# EAGLE design stm32f7 (EAGLE 6.6.0)
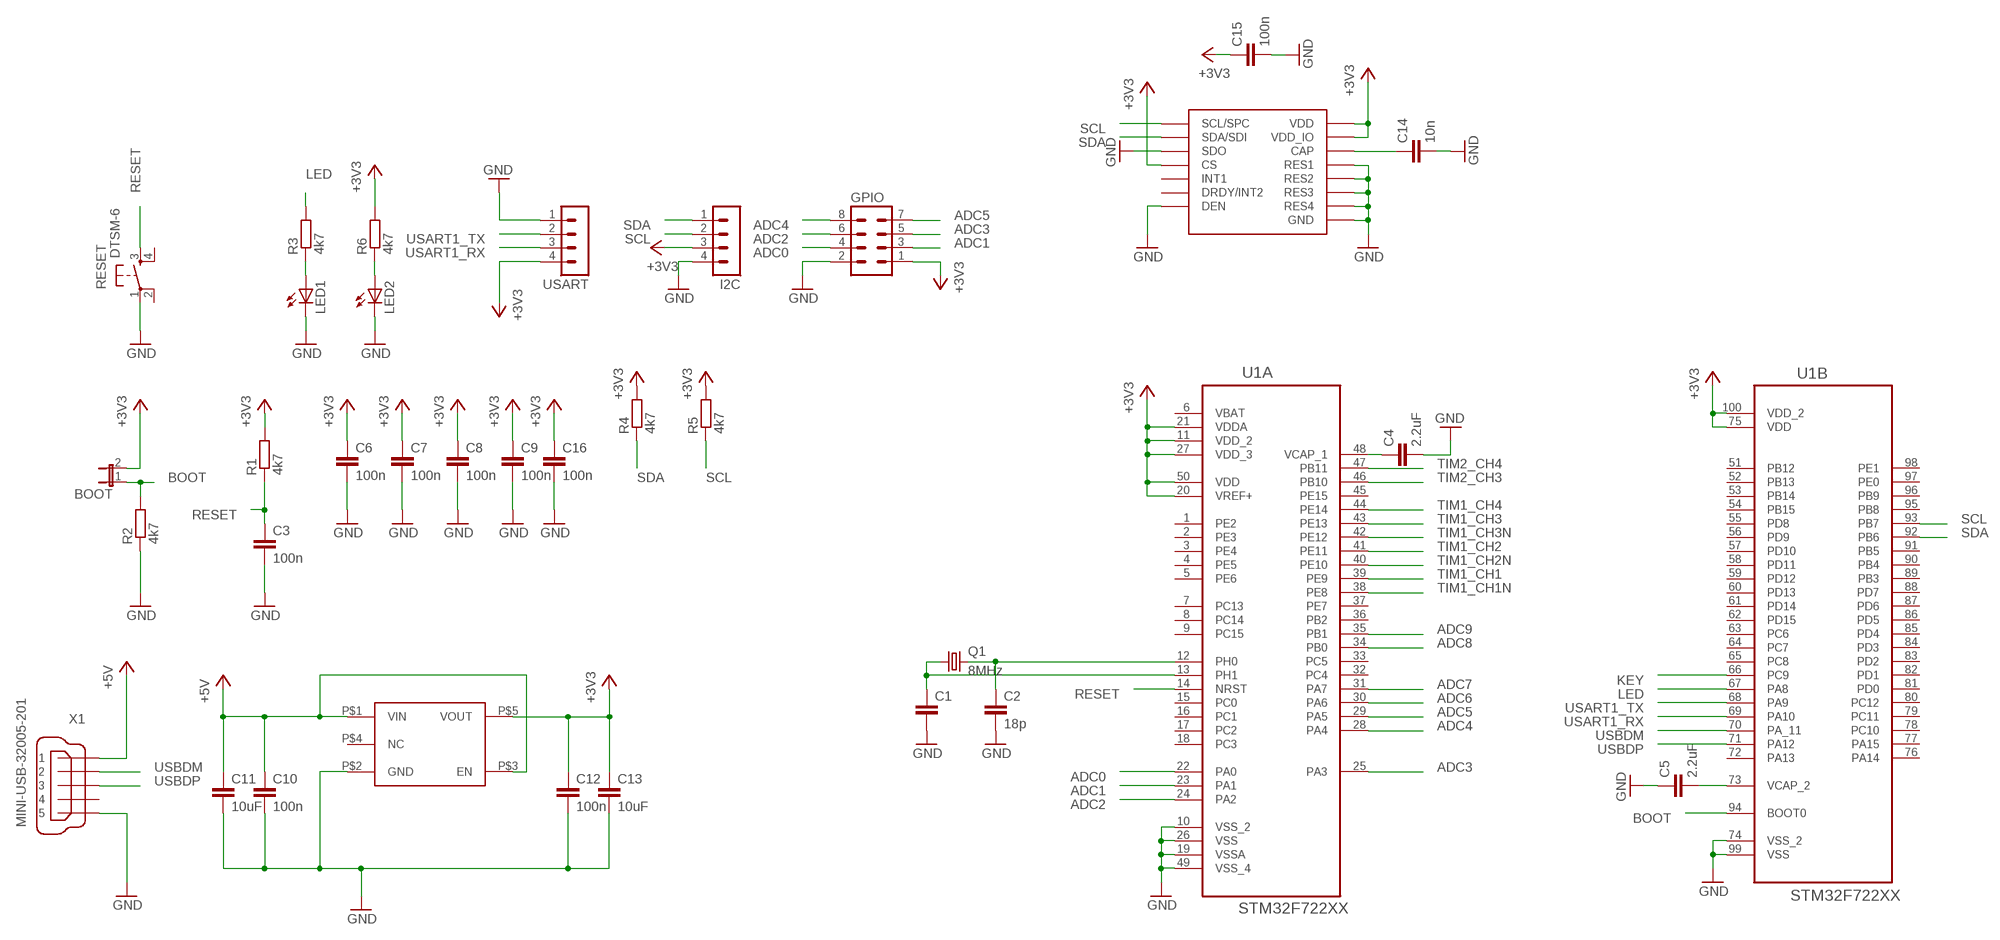
[diagram p0: schematic, sheet 1]

## Parts
BOOT  JP1E  [JP1]
C1  C-EUC0805  [C0805]
C2  18p  C-EUC0805  [C0805]
C3  100n  C-EUC0805  [C0805]
C4  2.2uF  C-EUC0805  [C0805]
C5  2.2uF  C-EUC0805  [C0805]
C6  100n  C-EUC0805  [C0805]
C7  100n  C-EUC0805  [C0805]
C8  100n  C-EUC0805  [C0805]
C9  100n  C-EUC0805  [C0805]
C10  100n  C-EUC0805  [C0805]
C11  10uF  C-EUC0805  [C0805]
C12  100n  C-EUC0805  [C0805]
C13  10uF  C-EUC0805  [C0805]
C14  10n  C-EUC0805  [C0805]
C15  100n  C-EUC0805  [C0805]
C16  100n  C-EUC0805  [C0805]
GPIO  MA04-2  [MA04-2]
I2C  MA04-1  [MA04-1]
LED1  LEDCHIPLED_1206  [CHIPLED_1206]
LED2  LEDCHIPLED_1206  [CHIPLED_1206]
Q1  8MHz  CRYSTALCTS406  [CTS406]
R1  4k7  R-EU_M0805  [M0805]
R2  4k7  R-EU_M0805  [M0805]
R3  4k7  R-EU_M0805  [M0805]
R4  4k7  R-EU_M0805  [M0805]
R5  4k7  R-EU_M0805  [M0805]
R6  4k7  R-EU_M0805  [M0805]
RESET  DTSM-6  [DTSM-6]
U1  STM32F722XX  [QFP50P1600X1600X160-100N]
U$1  MIC5504-3.3Y  [SOT23-5]
U$2  ST_L3GD20H  [ST_LGA16L]
USART  MA04-1  [MA04-1]
X1  MINI-USB-32005-201  [32005-201]

## Nets
+3V3: BOOT.2 C6.1 C7.1 C8.1 C9.1 C12.1 C13.1 C15.1 C16.1 GPIO.1 I2C.3 R1.2 R4.2 R5.2 R6.2 U1.11(A:VDD_2) U1.20(A:VREF+) U1.21(A:VDDA) U1.27(A:VDD_3) U1.50(A:VDD) U1.75(B:VDD) U1.100(B:VDD_2) U$1.P$5(VOUT) U$2.P$1(VDD_IO) U$2.P$5(CS) U$2.P$16(VDD) USART.4
+5V: C10.1 C11.1 U$1.P$1(VIN) U$1.P$3(EN) X1.1
ADC0: GPIO.4 U1.22(A:PA0)
ADC1: GPIO.3 U1.23(A:PA1)
ADC2: GPIO.6 U1.24(A:PA2)
ADC3: GPIO.5 U1.25(A:PA3)
ADC4: GPIO.8 U1.28(A:PA4)
ADC5: GPIO.7 U1.29(A:PA5)
ADC6: U1.30(A:PA6)
ADC7: U1.31(A:PA7)
ADC8: U1.34(A:PB0)
ADC9: U1.35(A:PB1)
BOOT: BOOT.1 R2.2 U1.94(B:BOOT0)
GND: C1.2 C2.2 C3.2 C4.2 C5.1 C6.2 C7.2 C8.2 C9.2 C10.2 C11.2 C12.2 C13.2 C14.2 C15.2 C16.2 GPIO.2 I2C.4 LED1.C LED2.C R2.1 RESET.1 U1.10(A:VSS_2) U1.19(A:VSSA) U1.26(A:VSS) U1.49(A:VSS_4) U1.74(B:VSS_2) U1.99(B:VSS) U$1.P$2(GND) U$2.P$4(SDO) U$2.P$8(DEN) U$2.P$9(RES1) U$2.P$10(RES2) U$2.P$11(RES3) U$2.P$12(GND) U$2.P$13(GND) U$2.P$15(RES4) USART.1 X1.5
KEY: U1.66(B:PC9)
LED: R3.2 U1.67(B:PA8)
N$1: C2.1 Q1.3 U1.12(A:PH0)
N$2: C1.1 Q1.1 U1.13(A:PH1)
N$3: C4.1 U1.48(A:VCAP_1)
N$4: C5.2 U1.73(B:VCAP_2)
N$5: LED1.A R3.1
N$6: C14.1 U$2.P$14(CAP)
N$11: LED2.A R6.1
RESET: C3.1 R1.1 RESET.3 U1.14(A:NRST)
SCL: I2C.2 R5.1 U1.93(B:PB7) U$2.P$2(SCL/SPC)
SDA: I2C.1 R4.1 U1.92(B:PB6) U$2.P$3(SDA/SDI)
TIM1_CH1: U1.39(A:PE9)
TIM1_CH1N: U1.38(A:PE8)
TIM1_CH2: U1.41(A:PE11)
TIM1_CH2N: U1.40(A:PE10)
TIM1_CH3: U1.43(A:PE13)
TIM1_CH3N: U1.42(A:PE12)
TIM1_CH4: U1.44(A:PE14)
TIM2_CH3: U1.46(A:PB10)
TIM2_CH4: U1.47(A:PB11)
USART1_RX: U1.69(B:PA10) USART.3
USART1_TX: U1.68(B:PA9) USART.2
USBDM: U1.70(B:PA_11) X1.2
USBDP: U1.71(B:PA12) X1.3
Unconnected: RESET.2 RESET.4 U1.1(A:PE2) U1.2(A:PE3) U1.3(A:PE4) U1.4(A:PE5) U1.5(A:PE6) U1.7(A:PC13) U1.8(A:PC14) U1.9(A:PC15) U1.15(A:PC0) U1.16(A:PC1) U1.17(A:PC2) U1.18(A:PC3) U1.32(A:PC4) U1.33(A:PC5) U1.36(A:PB2) U1.37(A:PE7) U1.45(A:PE15) U1.51(B:PB12) U1.52(B:PB13) U1.53(B:PB14) U1.54(B:PB15) U1.55(B:PD8) U1.56(B:PD9) U1.57(B:PD10) U1.58(B:PD11) U1.59(B:PD12) U1.60(B:PD13) U1.61(B:PD14) U1.62(B:PD15) U1.63(B:PC6) U1.64(B:PC7) U1.65(B:PC8) U1.72(B:PA13) U1.76(B:PA14) U1.77(B:PA15) U1.78(B:PC10) U1.79(B:PC11) U1.80(B:PC12) U1.81(B:PD0) U1.82(B:PD1) U1.83(B:PD2) U1.84(B:PD3) U1.85(B:PD4) U1.86(B:PD5) U1.87(B:PD6) U1.88(B:PD7) U1.89(B:PB3) U1.90(B:PB4) U1.91(B:PB5) U1.95(B:PB8) U1.96(B:PB9) U1.97(B:PE0) U1.98(B:PE1) U$1.P$4(NC) U$2.P$6(DRDY/INT2) U$2.P$7(INT1) X1.4

## Power pins joined to a net without a drawn wire
VBAT: U1.6(A:VBAT)

## Library data of the parts
BOOT = jumper:JP1E: JUMPER
C1-C16 = resistor:C-EU: CAPACITOR, European symbol
GPIO = con-lstb:MA04-2: PIN HEADER; OC_FARNELL: unknown; OC_NEWARK: unknown
I2C USART = con-lstb:MA04-1: PIN HEADER; OC_FARNELL: unknown; OC_NEWARK: unknown
LED1 LED2 = my_parts:LED: LED OSRAM: - CHIPLED LG R971, LG N971, LY N971, LG Q971, LY Q971, LO R971, LY R971 LH N974, LH R974 LS Q976, LO Q976, LY Q976 LO Q996 - Hyper CHIPLED LW Q18S LB Q993, LB Q99A, LB R99A - SideLED LS A670, LO A670, LY A670, LG A670, LP A670 LB A673, LV A673, LT A673, LW A673 LH A674 LY A675 LS A676, LA A676, LO A676, LY A676, LW A676 LS A679, LY A679, LG A679 - Hyper Micro SIDELED® LS Y876, LA Y876, LO Y876, LY Y876 LT Y87S - SmartLED LW L88C, LW L88S LB L89C, LB L89S, LG L890 LS L89K, LO L89K, LY L89K LS L896, LA L896, LO L896, LY L896 - TOPLED LS T670, LO T670, LY T670, LG T670, LP T670 LSG T670, LSP T670, LSY T670, LOP T670, LYG T670 LG T671, LOG T671, LSG T671 LB T673, LV T673, LT T673, LW T673 LH T674 LS T676, LA T676, LO T676, LY T676, LB T676, LH T676, LSB T676, LW T676 LB T67C, LV T67C, LT T67C, LS T67K, LO T67K, LY T67K, LW E67C LS E67B, LA E67B, LO E67B, LY E67B, LB E67C, LV E67C, LT E67C LW T67C LS T679, LY T679, LG T679 LS T770, LO T770, LY T770, LG T770, LP T770 LB T773, LV T773, LT T773, LW T773 LH T774 LS E675, LA E675, LY E675, LS T675 LS T776, LA T776, LO T776, LY T776, LB T776 LHGB T686 LT T68C, LB T68C - Hyper Mini TOPLED® LB M676 - Mini TOPLED Santana® LG M470 LS M47K, LO M47K, LY M47K Source: http://www.osram.convergy.de LUXEON: - LUMILED® LXK2-PW12-R00, LXK2-PW12-S00, LXK2-PW14-U00, LXK2-PW14-V00 LXK2-PM12-R00, LXK2-PM12-S00, LXK2-PM14-U00 LXK2-PE12-Q00, LXK2-PE12-R00, LXK2-PE12-S00, LXK2-PE14-T00, LXK2-PE14-U00 LXK2-PB12-K00, LXK2-PB12-L00, LXK2-PB12-M00, LXK2-PB14-N00, LXK2-PB14-P00, LXK2-PB14-Q00 LXK2-PR12-L00, LXK2-PR12-M00, LXK2-PR14-Q00, LXK2-PR14-R00 LXK2-PD12-Q00, LXK2-PD12-R00, LXK2-PD12-S00 LXK2-PH12-R00, LXK2-PH12-S00 LXK2-PL12-P00, LXK2-PL12-Q00, LXK2-PL12-R00 Source: www.luxeon.com KINGBRIGHT: KA-3528ASYC Source: www.kingbright.com
Q1 = crystal:CRYSTAL: CRYSTAL; OC_FARNELL: unknown; OC_NEWARK: unknown
R1-R6 = resistor:R-EU_: RESISTOR, European symbol
RESET = switch-tact:DTSM-6
U1 = stm32:STM32F722XX: IC, MCU, 32BIT, 512K FLASH, 100LQFP; MPN: STM32F407VET6; OC_FARNELL: 2064367; OC_NEWARK: 73T2332; PACKAGE: 100LQFP; SUPPLIER: STMicroelectronics
U$1 = my_parts:MIC5504-3.3Y
U$2 = main:ST_L3GD20H
X1 = con-cypressindustries:MINI-USB-: MINI USB-B Conector Source: www.cypressindustries.com; OC_FARNELL: unknown; OC_NEWARK: unknown

## Board
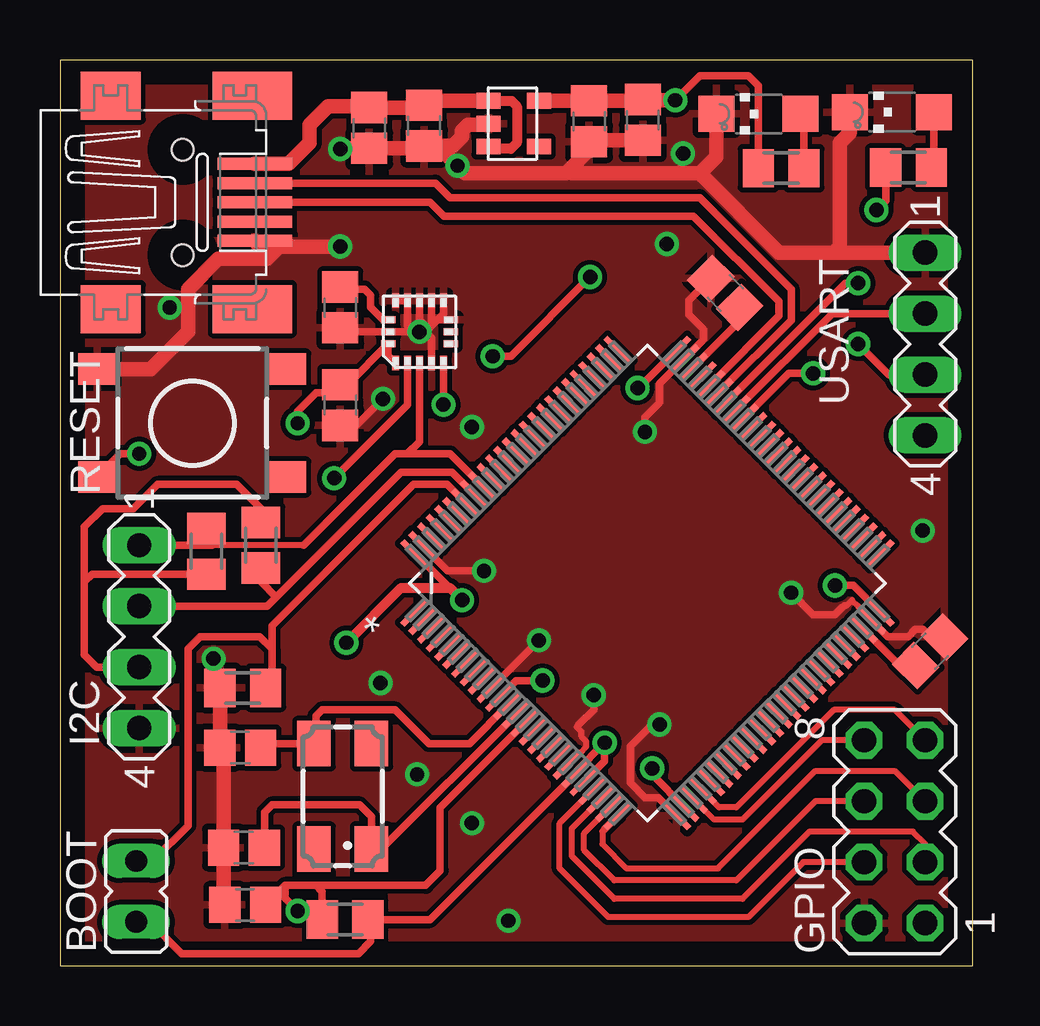
[diagram p1: board, top side]
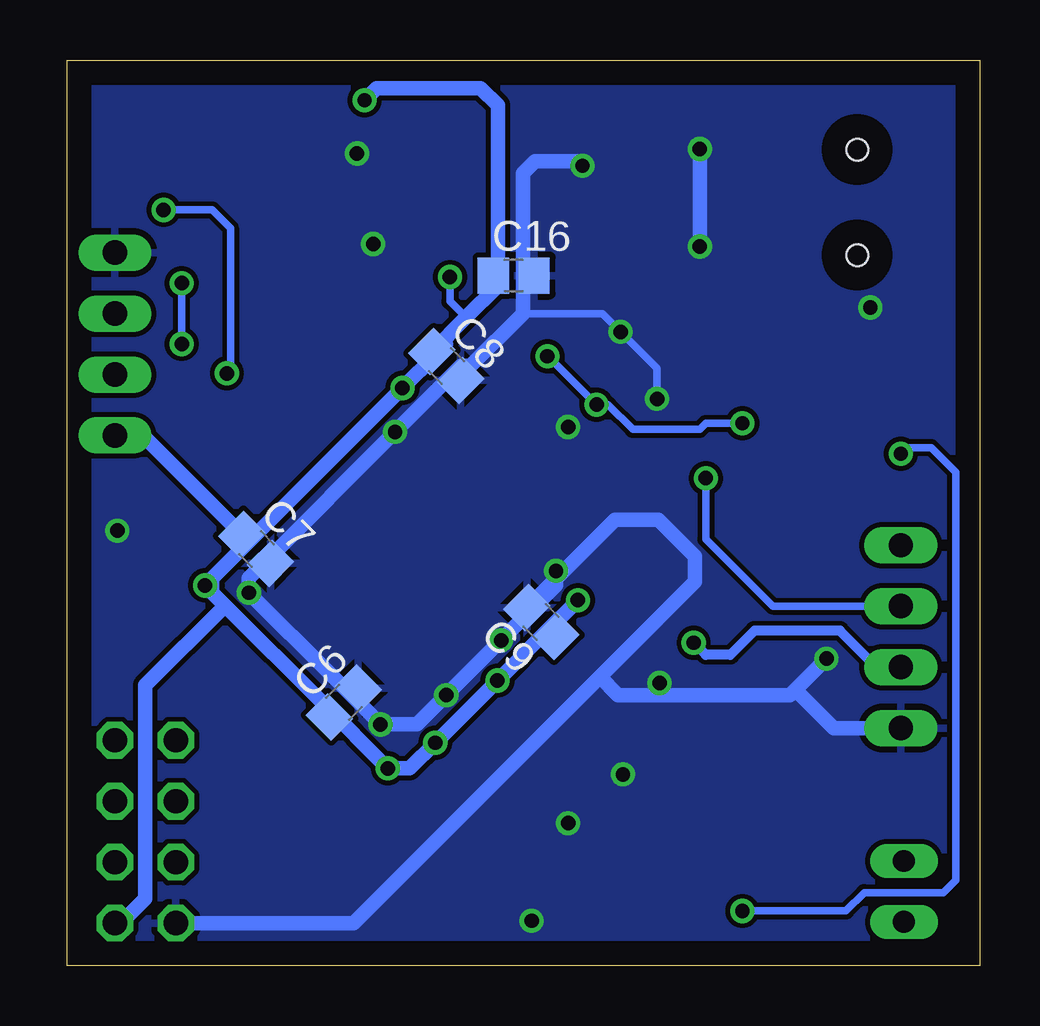
[diagram p2: board, bottom side, seen from below]

Size 38.05 x 37.74 mm. Coordinates in mm from the lower left corner, seen from the top.
Outline: 0,0 38.05,0 38.05,37.74 0,37.74 0,0
Copper layers (1*16): Top 0.035mm / dielectric 1.5mm / Bottom 0.035mm
Design rules "default": minimum track width 10mil, minimum drill 24mil, track to track 8mil, track to pad 8mil, pad to pad 8mil, via to via 8mil, smd to smd 8mil, copper to edge 40mil, drill to drill 8mil, minimum pad ring 10mil, minimum via ring 8mil, stop-mask expansion 4mil, vias tented up to drill 0mil, thermal gap 10mil

### Footprints (pad centres in the part's own frame; a part is rotated, then mirrored left to right if it is on the bottom)
JP1 = drill 0.914 long: 1 0,-1.27; 2 0,1.27
C0805 = smd 1.3 x 1.5: 1 -0.85,0; 2 0.85,0
MA04-2 = drill 1.016 octagon: 1 -3.81,-1.27; 2 -3.81,1.27; 3 -1.27,-1.27; 4 -1.27,1.27; 5 1.27,-1.27; 6 1.27,1.27; 7 3.81,-1.27; 8 3.81,1.27
MA04-1 = drill 1.016 long: 1 -3.81,0; 2 -1.27,0; 3 1.27,0; 4 3.81,0
CHIPLED_1206 = smd 1.5 x 1.5: A 0,-1.75; C 0,1.75
CTS406 = smd 1.9 x 1.4: 1 -2.2,-1.2; 2 2.2,-1.2; 3 2.2,1.2; 4 -2.2,1.2
M0805 = smd 1.3 x 1.6: 1 -0.95,0; 2 0.95,0
DTSM-6 = smd 1.55 x 1.3: 1 -3.975,2.25; 2 3.975,2.25; 3 -3.975,-2.25; 4 3.975,-2.25
QFP50P1600X1600X160-100N = smd 1.473 x 0.254: 1 -7.722,5.994; 2 -7.722,5.512; 3 -7.722,5.004; 4 -7.722,4.496; 5 -7.722,3.988; 6 -7.722,3.505; 7 -7.722,2.997; 8 -7.722,2.489; 9 -7.722,2.007; 10 -7.722,1.499; 11 -7.722,0.991; 12 -7.722,0.508; 13 -7.722,0; 14 -7.722,-0.508; 15 -7.722,-0.991; 16 -7.722,-1.499; 17 -7.722,-2.007; 18 -7.722,-2.489; 19 -7.722,-2.997; 20 -7.722,-3.505; 21 -7.722,-3.988; 22 -7.722,-4.496; 23 -7.722,-5.004; 24 -7.722,-5.512; 25 -7.722,-5.994; 51 7.722,-5.994; 52 7.722,-5.512; 53 7.722,-5.004; 54 7.722,-4.496; 55 7.722,-3.988; 56 7.722,-3.505; 57 7.722,-2.997; 58 7.722,-2.489; 59 7.722,-2.007; 60 7.722,-1.499; 61 7.722,-0.991; 62 7.722,-0.508; 63 7.722,0; 64 7.722,0.508; 65 7.722,0.991; 66 7.722,1.499; 67 7.722,2.007; 68 7.722,2.489; 69 7.722,2.997; 70 7.722,3.505; 71 7.722,3.988; 72 7.722,4.496; 73 7.722,5.004; 74 7.722,5.512; 75 7.722,5.994 | smd 0.254 x 1.473: 26 -5.994,-7.722; 27 -5.512,-7.722; 28 -5.004,-7.722; 29 -4.496,-7.722; 30 -3.988,-7.722; 31 -3.505,-7.722; 32 -2.997,-7.722; 33 -2.489,-7.722; 34 -2.007,-7.722; 35 -1.499,-7.722; 36 -0.991,-7.722; 37 -0.508,-7.722; 38 0,-7.722; 39 0.508,-7.722; 40 0.991,-7.722; 41 1.499,-7.722; 42 2.007,-7.722; 43 2.489,-7.722; 44 2.997,-7.722; 45 3.505,-7.722; 46 3.988,-7.722; 47 4.496,-7.722; 48 5.004,-7.722; 49 5.512,-7.722; 50 5.994,-7.722; 76 5.994,7.722; 77 5.512,7.722; 78 5.004,7.722; 79 4.496,7.722; 80 3.988,7.722; 81 3.505,7.722; 82 2.997,7.722; 83 2.489,7.722; 84 2.007,7.722; 85 1.499,7.722; 86 0.991,7.722; 87 0.508,7.722; 88 0,7.722; 89 -0.508,7.722; 90 -0.991,7.722; 91 -1.499,7.722; 92 -2.007,7.722; 93 -2.489,7.722; 94 -2.997,7.722; 95 -3.505,7.722; 96 -3.988,7.722; 97 -4.496,7.722; 98 -5.004,7.722; 99 -5.512,7.722; 100 -5.994,7.722
SOT23-5 = smd 0.66 x 1: P$1 0.95,1; P$2 0,1; P$3 -0.95,1; P$4 -0.95,-1.1; P$5 0.95,-1.1
ST_LGA16L = smd 0.6 x 0.3: P$1 -1.3,1; P$2 -1.3,0.5; P$3 -1.3,0; P$4 -1.3,-0.5; P$5 -1.3,-1; P$9 1.3,-1; P$10 1.3,-0.5; P$11 1.3,0; P$12 1.3,0.5; P$13 1.3,1 | smd 0.3 x 0.6: P$6 -0.5,-1.3; P$7 0,-1.3; P$8 0.5,-1.3; P$14 0.5,1.3; P$15 0,1.3; P$16 -0.5,1.3
32005-201 = smd 3.1 x 0.5: 1 3,1.6; 2 3,0.8; 3 3,0; 4 3,-0.8; 5 3,-1.6 | smd 2.5 x 2: M1 -3,-4.45; M2 -3,4.45 | smd 3.3 x 2: M3 2.9,4.45; M4 2.9,-4.45 | hole 0.9: 0,2.2; 0,-2.2

### Placement (x,y rotation side)
BOOT  3.17,3.1 180 top
C1  7.67,4.93 180 top
C2  7.52,9.09 180 top
C3  7.72,2.54 180 top
C4  36.27,13.11 45 top
C5  27.74,28.04 315 top
C6  26.52,10.97 45 bottom
C7  30.18,17.37 315 bottom
C8  22.25,24.99 315 bottom
C9  18.29,14.33 135 bottom
C10  15.18,35.01 270 top
C11  12.89,34.91 270 top
C12  22.06,35.19 270 top
C13  24.29,35.24 270 top
C14  11.68,27.43 270 top
C15  11.68,23.37 270 top
C16  19.44,28.76 0 bottom
GPIO  34.8,5.59 90 top
I2C  3.3,13.72 270 top
LED1  34.68,35.57 90 top
LED2  29.12,35.5 90 top
Q1  11.79,7.06 90 top
R1  11.89,1.93 0 top
R2  7.62,11.58 0 top
R3  35.37,33.26 180 top
R4  6.1,17.27 270 top
R5  8.38,17.53 90 top
R6  30.06,33.23 180 top
RESET  5.52,22.61 0 top
U1  24.49,15.95 45 top
U$1  18.86,35.09 90 top
U$2  14.99,26.42 90 top
USART  36.07,25.91 270 top
X1  5.12,31.81 0 top

### Tracks (layer width: path | path; a pad name or v marks a point on that pad's centre or on a via)
+3V3  (via drill 0.6)
  Top 0.305: U1.100 14.83,17.17 v16.76,15.24 15.85,16.15 | v32.31,15.85 33.06,15.85 U1.50 | v24.69,8.23 24.69,7.95 U1.27 | v20.12,11.89 19.02,11.89 U1.11 | U1.21 22.71,8.53 v22.71,9.3 21.5,8.09 U1.20 15.42,1.93 R1.2 12.95,1.81 12.95,1.02 12.45,0.51 5.08,0.51 3.76,1.83 BOOT.2 | v24.08,24.08 24.14,24.08 U1.75 | R6.2 29.11,36.67 28.7,37.08 26.67,37.08 v25.65,36.07 | R4.2 1.34,16.32 1.02,16 | 1.02,16 1.02,12.95 1.52,12.45 I2C.3 | R5.2 8.38,19.05 7.37,20.07 4.06,20.07 3.05,19.05 1.78,19.05 1.02,18.29 1.02,16 | U$2.P$1 13.69,25.42 U$2.P$16 11.99,24.22 C15.1 11.34,23.88 10.67,23.88 9.91,23.11 v9.91,22.61 | U$2.P$5 v15.99,23.38 | v18.03,25.4 18.8,25.4 v22.1,28.7
  Top 0.406: v11.94,13.46 14.22,15.75 16.26,15.75 v16.76,15.24
  Top 0.61: U$1.P$5 C12.1 24.24,36.04 C13.1 24.32,36.07 v25.65,36.07
  Bottom 0.305: 32,15.54 v32.31,15.85 | C7.1 30.49,17.67 31.09,17.07 | C6.1 27.12,10.66 27.43,10.97 | C9.1 17.99,13.72 18.14,13.87 | C8.1 22.71,25.45 | C16.1 20.3,29.27 20.1,29.46 | v9.91,22.61 11.43,22.61 11.68,22.35 14.48,22.35 15.51,23.38 v15.99,23.38 18,25.4 v18.03,25.4 | v22.1,28.7 22.1,27.69 21.43,27.02
  Bottom 0.406: I2C.3 4.32,12.45 5.84,13.97 9.4,13.97 10.41,12.95 11.43,12.95 v11.94,13.46
  Bottom 0.61: v16.76,15.24 18.14,13.87 v20.12,11.89 v22.71,9.3 23.77,8.23 v24.69,8.23 27.43,10.97 31.47,15.01 | 31.47,15.01 32,15.54 32,16.15 31.09,17.07 v24.08,24.08 22.71,25.45 22.25,25.91 | C8.1 21.43,27.02 20.1,28.35 20.1,29.46 20.1,35.85 20.83,36.58 25.15,36.58 v25.65,36.07 | GPIO.1 35.81,1.78 34.8,2.79 34.8,11.68 31.47,15.01 | USART.4 34.9,22.1 C7.1
+5V
  Top 0.406: U$1.P$1 18.82,36.04 19.05,35.81 19.05,34.29 18.8,34.04 17.97,34.04 U$1.P$3
  Top 0.61: X1.1 9.54,33.41 10.41,34.29 10.41,35.05 11.18,35.81 12.84,35.81 C11.1 15.08,35.76 C10.1 15.35,36.04 U$1.P$1
ADC0
  Top 0.254: GPIO.4 30.99,4.32 28.7,2.03 22.86,2.03 20.83,4.06 20.83,5.94 U1.22
ADC1
  Top 0.254: GPIO.3 36.07,5.08 35.56,5.59 31.24,5.59 28.45,2.79 23.11,2.79 21.34,4.57 21.34,5.72 U1.23
ADC2
  Top 0.254: GPIO.6 31.5,6.86 28.19,3.56 23.11,3.56 21.84,4.83 21.84,5.51 U1.24
ADC3
  Top 0.254: U1.25 22.61,5.59 22.61,5.08 23.62,4.06 27.43,4.06 31.5,8.13 34.8,8.13 GPIO.5
  Top 0.305: 22.71,5.7 U1.25
ADC4
  Top 0.254: GPIO.8 31.75,9.4 28.45,6.1 27.26,6.1 U1.28
ADC5
  Top 0.254: GPIO.7 34.8,10.67 32.26,10.67 28.19,6.6 27.48,6.6 U1.29
BOOT
  Top 0.305: 8.84,13.21 8.84,11.85 R2.2 | BOOT.1 3.86,4.37 5.33,5.84 5.33,13.21 5.84,13.72 8.33,13.72 8.84,13.21 | 8.84,13.21 8.84,14.17 14.73,20.07 16.13,20.07 U1.94
GND  (via drill 0.6)
  Top 0.254: 21.64,8.87 21.67,8.87 21.95,9.14 21.95,9.35 21.74,9.55 21.74,9.75 21.54,9.96 21.64,10.06 | 32.61,14.94 32.72,15.04 | U1.49 33.84,14.42 33.27,14.99 | 33.3,14.94 33.3,14.96 33.02,15.24 32.77,14.99
  Top 0.305: 6.82,8.94 C2.2 | 21.17,8.37 U1.19 21.64,8.87 | U1.10 17.97,11.56 v19.96,13.56 | U1.99 15.13,17.48 16.15,16.46 v17.68,16.46 | v30.48,15.54 31.39,14.63 32.31,14.63 32.61,14.94 | v24.99,10.06 24.69,10.06 23.77,9.14 23.77,7.62 24.38,7.01 24.95,7.01 U1.26 | v22.25,11.28 22.25,10.67 21.64,10.06 | v24.38,22.25 24.38,22.86 24.99,23.47 24.99,24.25 U1.74 | U1.49 34.52,13.72 35.36,13.72 35.66,14.02 35.97,14.02 36.28,13.71 C4.2 | 26.52,25.78 U1.74 | C5.1 27.12,28.64 26.21,27.74 26.21,27.13 26.82,26.52 26.82,26.08 U1.74 | v25.97,33.84 25.97,33.34 25.65,33.02 | v4.57,27.43 5.33,27.43 | U$2.P$4 15.49,26.17 15.24,26.42 | U$2.P$8 15.74,26.92 | 15.74,26.92 15.49,26.66 | U$2.P$9 15.99,27.16 15.74,26.92 | U$2.P$10 15.49,26.66 | 15.49,26.66 15.37,26.54 | U$2.P$11 14.99,26.92 15.37,26.54 | U$2.P$13 U$2.P$12 14.49,26.66 14.73,26.42 | 14.73,26.42 U$2.P$15 11.85,26.42 C14.2 | 14.73,26.42 v14.99,26.42 15.24,26.42 | C15.2 12.36,22.52 v13.46,23.62 | 15.24,26.42 15.37,26.54
  Top 0.61: 6.55,5.19 C1.2 | v6.4,12.8 6.4,11.85 R2.1 C2.2 | 6.82,8.94 C1.2 | C1.2 6.82,2.59 C3.2 | 15.75,34.16 C10.2 15.08,34.06 C11.2 11.71,34.06 v11.68,34.04 | 15.75,34.16 16.38,34.16 16.76,34.54 16.76,34.8 17.02,35.05 17.83,35.05 U$1.P$2 | 21.21,33.15 22.06,34 C12.2 22.11,34.39 C13.2 | 21.21,33.15 21.08,33.02 16.89,33.02 v16.57,33.34 15.75,34.16 | v11.68,29.97 9.14,29.97 | 9.14,29.97 8.36,29.97 X1.5 | USART.1 32.26,29.72 | 32.26,29.72 29.97,29.72 26.67,33.02 | 26.67,33.02 25.65,33.02 21.34,33.02 21.21,33.15 | LED2.C 27.37,33.72 26.67,33.02 | LED1.C 32.94,34.71 32.51,34.29 32.51,29.97 32.26,29.72 | RESET.1 3.78,24.86 5.33,26.42 5.33,27.43 5.33,28.19 6.6,29.46 8.64,29.46 9.14,29.97
  Bottom 0.305: 23.47,10.06 v22.25,11.28 | C7.2 29.57,16.47 29.87,16.76 | C6.2 26.51,11.57 26.98,12.04 | C9.2 18.89,14.64 19.05,14.48 | C8.2 21.65,24.98 21.64,24.99 | C16.2 18.59,29.01 19.05,29.46 | v13.46,23.62 13.46,24.89 v14.99,26.42 15.75,27.18 19.05,27.18
  Bottom 0.61: v17.68,16.46 17.68,15.85 19.05,14.48 v19.96,13.56 23.47,10.06 v24.99,10.06 26.98,12.04 v30.48,15.54 30.48,16.15 29.87,16.76 v24.38,22.25 21.64,24.99 21.23,24.99 19.05,27.18 19.05,29.46 19.05,33.02 18.54,33.53 16.76,33.53 v16.57,33.34 | 7.7,11.51 7.92,11.28 15.09,11.28 15.85,12.04 | 7.7,11.51 v6.4,12.8 | C9.2 15.22,18.59 13.41,18.59 11.89,17.07 11.89,16 15.85,12.04 | GPIO.2 26.11,1.78 15.85,12.04 | v11.68,29.97 v11.68,34.04 | I2C.4 6.1,9.91 7.7,11.51
  other vias: 18.69,1.88 17.17,5.94 14.88,7.98 13.36,11.79 17.17,22.45 25.3,30.07 35.97,18.14
  pour Bottom: -5.33,39.37 40.64,39.37 40.64,-8.38 -5.33,-8.38
  pour Top: -10.16,44.7 46.74,44.7 46.74,-18.03 -10.16,-18.03
LED  (via drill 0.6)
  Top 0.305: v31.39,24.69 30.39,24.69 U1.67 | R3.2 34.42,31.88 v34.04,31.5
  Bottom 0.305: v34.04,31.5 32,31.5 31.24,30.73 31.24,24.84 v31.39,24.69
N$1
  Top 0.305: U1.12 17.08,9.26 15.38,9.26 13.97,10.67 10.92,10.67 10.67,10.41 10.67,9.34 Q1.3 8.54,9.26 C2.1
N$2
  Top 0.305: U1.13 13.4,4.86 Q1.1 12.99,6.22 12.5,6.71 8.84,6.71 8.53,6.4 8.53,4.94 C1.1
N$3
  Top 0.305: C4.1 35.01,12.51 U1.48
N$4
  Top 0.305: C5.2 28.34,26.88 U1.73
N$5
  Top 0.305: LED1.A 36.44,33.38 R3.1
N$6
  Top 0.305: U$2.P$14 13.47,26.92 12.95,27.43 12.95,27.94 12.7,28.19 11.77,28.19 C14.1
N$11
  Top 0.305: R6.1 31.01,35.36 LED2.A
RESET  (via drill 0.6)
  Top 0.305: U1.14 15.85,6.6 15.85,3.96 15.24,3.35 10.67,3.35 | 10.67,3.35 9.38,3.35 | 9.38,3.35 C3.1 | R1.1 10.94,3.08 10.67,3.35 | 9.38,3.35 9.38,2.81 v9.91,2.29 | v3.3,21.34 2.52,21.34 RESET.3
  Bottom 0.305: v9.91,2.29 5.59,2.29 4.83,3.05 1.52,3.05 1.02,3.56 1.02,20.57 2.03,21.59 3.05,21.59 v3.3,21.34
SCL  (via drill 0.6)
  Top 0.305: I2C.2 8.64,14.99 9.02,15.37 | 9.02,15.37 14.22,20.57 16.34,20.57 U1.93 | R5.1 8.38,16 9.02,15.37 | U$2.P$2 14.49,23.38 v11.43,20.32
  Bottom 0.305: v11.43,20.32 11.43,17.78 8.64,14.99 I2C.2
SDA
  Top 0.254: 10.16,17.53 6.35,17.53
  Top 0.305: I2C.1 6.35,17.53 6.1,17.78 R4.1 | 10.16,17.53 13.97,21.34 14.48,21.34 | 14.48,21.34 16.26,21.34 U1.92 | U$2.P$3 14.99,21.84 14.48,21.34
USART1_RX  (via drill 0.6)
  Top 0.305: USART.3 34.54,24.64 v33.27,25.91 | v33.27,28.45 32.74,28.45 U1.69
  Bottom 0.305: v33.27,25.91 v33.27,28.45
USART1_TX
  Top 0.305: USART.2 32.19,27.18 U1.68
USBDM
  Top 0.305: U1.70 30.48,26.9 30.48,28.19 26.67,32 16.26,32 15.65,32.61 X1.2
USBDP
  Top 0.305: X1.3 15.43,31.81 16,31.24 26.42,31.24 29.97,27.69 29.97,27.08 U1.71